# EAGLE design arduino_mega_shield (EAGLE 7.4.0)
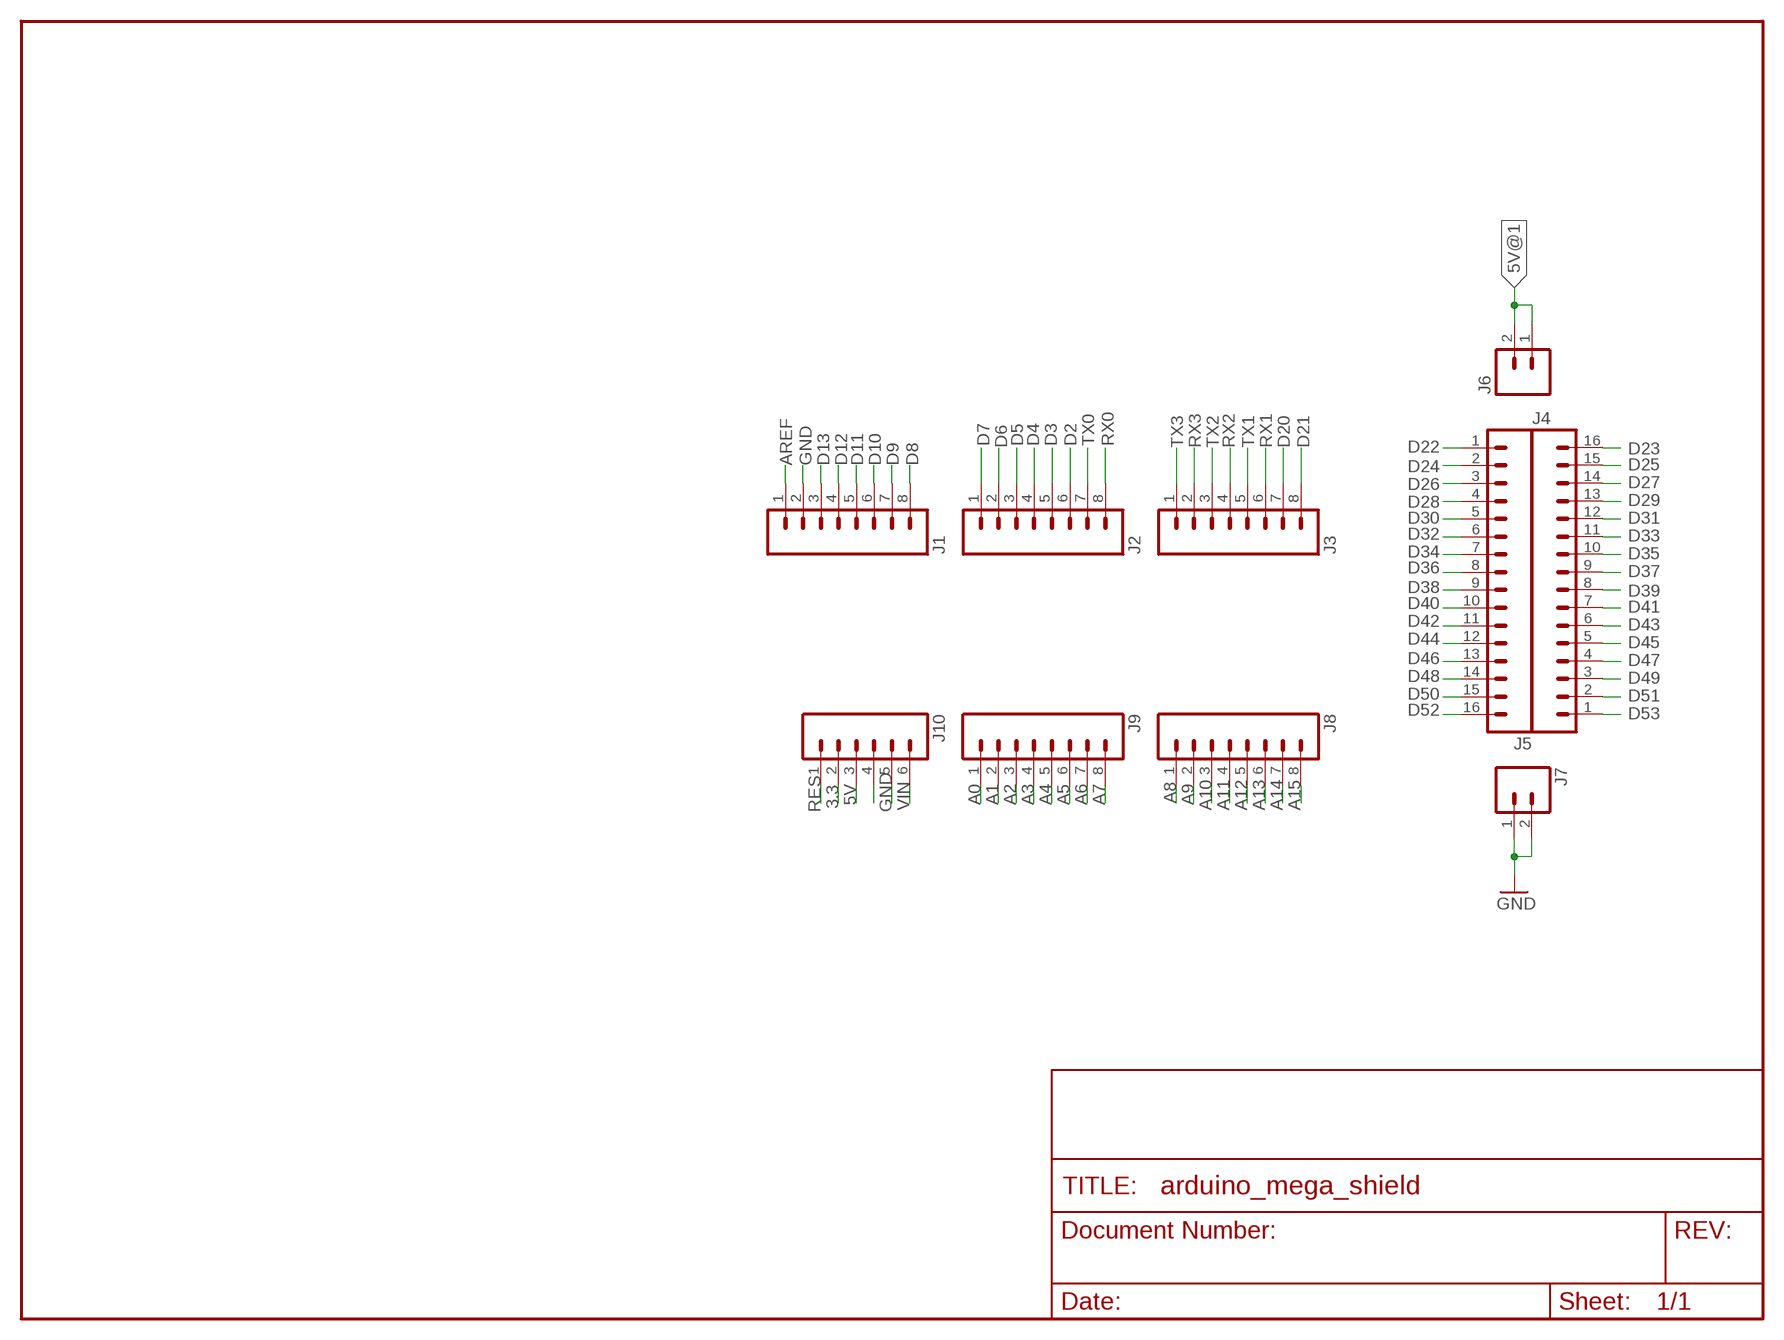
[diagram p0: schematic, sheet 1]

## Parts
J1  M08LONGPADS  [1X08_LONGPADS]
J2  M08LONGPADS  [1X08_LONGPADS]
J3  M08LONGPADS  [1X08_LONGPADS]
J4  M16PTH  [1X16]
J5  M16PTH  [1X16]
J6  M02PTH  [1X02]
J7  M02PTH  [1X02]
J8  M08LONGPADS  [1X08_LONGPADS]
J9  M08LONGPADS  [1X08_LONGPADS]
J10  M06LONGPADS  [1X06_LONGPADS]

## Nets
3.3: J10.2
5V: J10.3
5V@1: J6.1 J6.2
A0: J9.1
A1: J9.2
A2: J9.3
A3: J9.4
A4: J9.5
A5: J9.6
A6: J9.7
A7: J9.8
A8: J8.1
A9: J8.2
A10: J8.3
A11: J8.4
A12: J8.5
A13: J8.6
A14: J8.7
A15: J8.8
AREF: J1.1
D2: J2.6
D3: J2.5
D4: J2.4
D5: J2.3
D6: J2.2
D7: J2.1
D8: J1.8
D9: J1.7
D10: J1.6
D11: J1.5
D12: J1.4
D13: J1.3
D20: J3.7
D21: J3.8
D22: J5.1
D23: J4.16
D24: J5.2
D25: J4.15
D26: J5.3
D27: J4.14
D28: J5.4
D29: J4.13
D30: J5.5
D31: J4.12
D32: J5.6
D33: J4.11
D34: J5.7
D35: J4.10
D36: J5.8
D37: J4.9
D38: J5.9
D39: J4.8
D40: J5.10
D41: J4.7
D42: J5.11
D43: J4.6
D44: J5.12
D45: J4.5
D46: J5.13
D47: J4.4
D48: J5.14
D49: J4.3
D50: J5.15
D51: J4.2
D52: J5.16
D53: J4.1
GND: J1.2 J7.1 J7.2 J10.4 J10.5
RES: J10.1
RX0: J2.8
RX1: J3.6
RX2: J3.4
RX3: J3.2
TX0: J2.7
TX1: J3.5
TX2: J3.3
TX3: J3.1
VIN: J10.6

## Library data of the parts
J1-J3 J8 J9 = mecatronica_eagle_lib:M08: Header 8 Standard 8-pin 0.1" header. Use with straight break away headers (SKU : PRT-00116), right angle break away headers (PRT-00553), swiss pins (PRT-00743), machine pins (PRT-00117), and female headers (PRT-00115).
J4 J5 = mecatronica_eagle_lib:M16: 1x16 .1" header
J6 J7 = mecatronica_eagle_lib:M02: Standard 2-pin 0.1" header. Use with - straight break away headers ( PRT-00116) - right angle break away headers (PRT-00553) - swiss pins (PRT-00743) - machine pins (PRT-00117) - female headers (PRT-00115) Molex polarized connector foot print use with: PRT-08233 with associated crimp pins and housings. 2.54_SCREWTERM for use with PRT-10571. 3.5mm Screw Terminal footprints for PRT-08084 5mm Screw Terminal footprints for use with PRT-08432
J10 = mecatronica_eagle_lib:M06: Header 6 Standard 6-pin 0.1" header. Use with straight break away headers (SKU : PRT-00116), right angle break away headers (PRT-00553), swiss pins (PRT-00743), machine pins (PRT-00117), and female headers (PRT-00115). Molex polarized connector foot print use with SKU : PRT-08094 with associated crimp pins and housings. NOTES ON THE VARIANTS LOCK and LOCK_LONGPADS... This footprint was designed to help hold the alignment of a through-hole component (i.e. 6-pin header) while soldering it into place. You may notice that each hole has been shifted either up or down by 0.005 of an inch from it's more standard position (which is a perfectly straight line). This slight alteration caused the pins (the squares in the middle) to touch the edges of the holes. Because they are alternating, it causes a "brace" to hold the component in place. 0.005 has proven to be the perfect amount of "off-center" position when using our standard breakaway headers. Although looks a little odd when you look at the bare footprint, once you have a header in there, the alteration is very hard to notice. Also,if you push a header all the way into place, it is covered up entirely on the bottom side. This idea of altering the position of holes to aid alignment will be further integrated into the Sparkfun Library for other footprints. It can help hold any component with 3 or more connection pins.

## Board
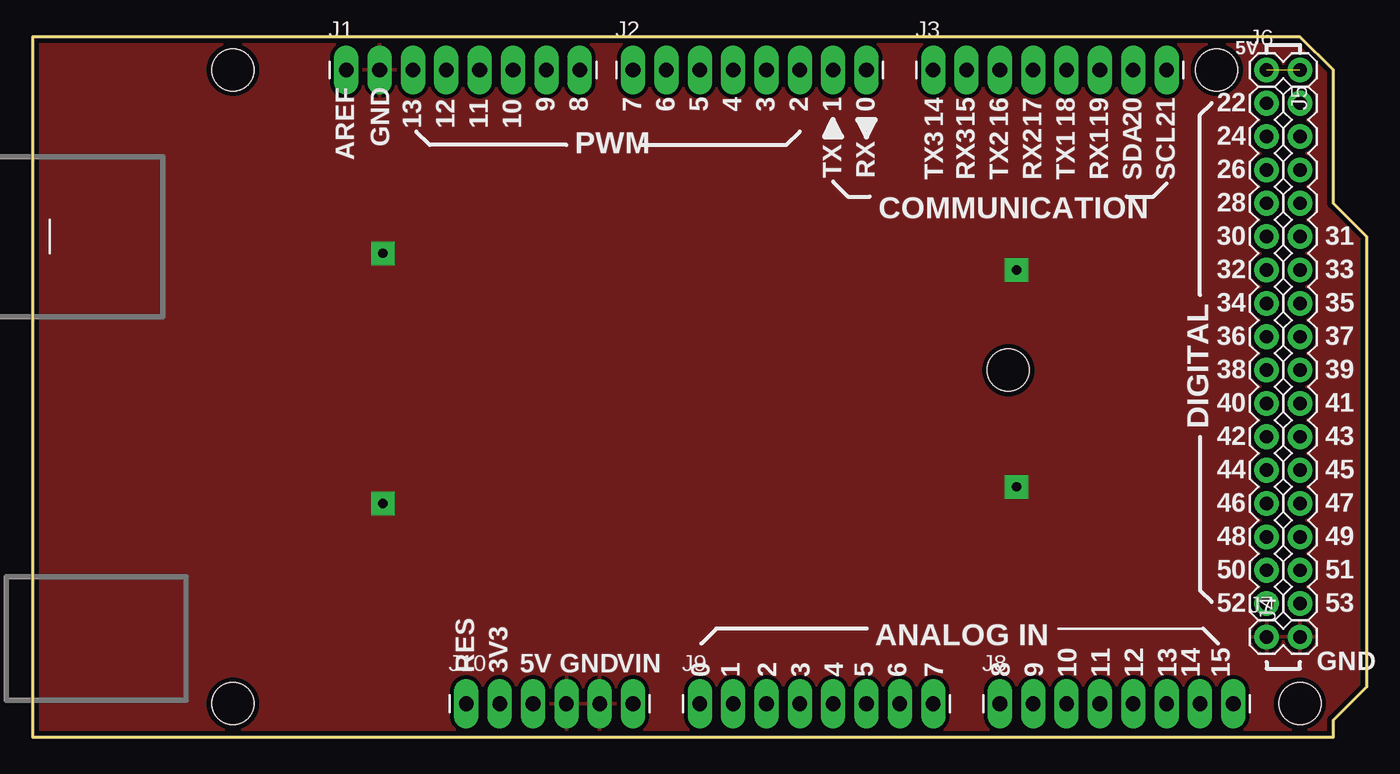
[diagram p1: board, top side]
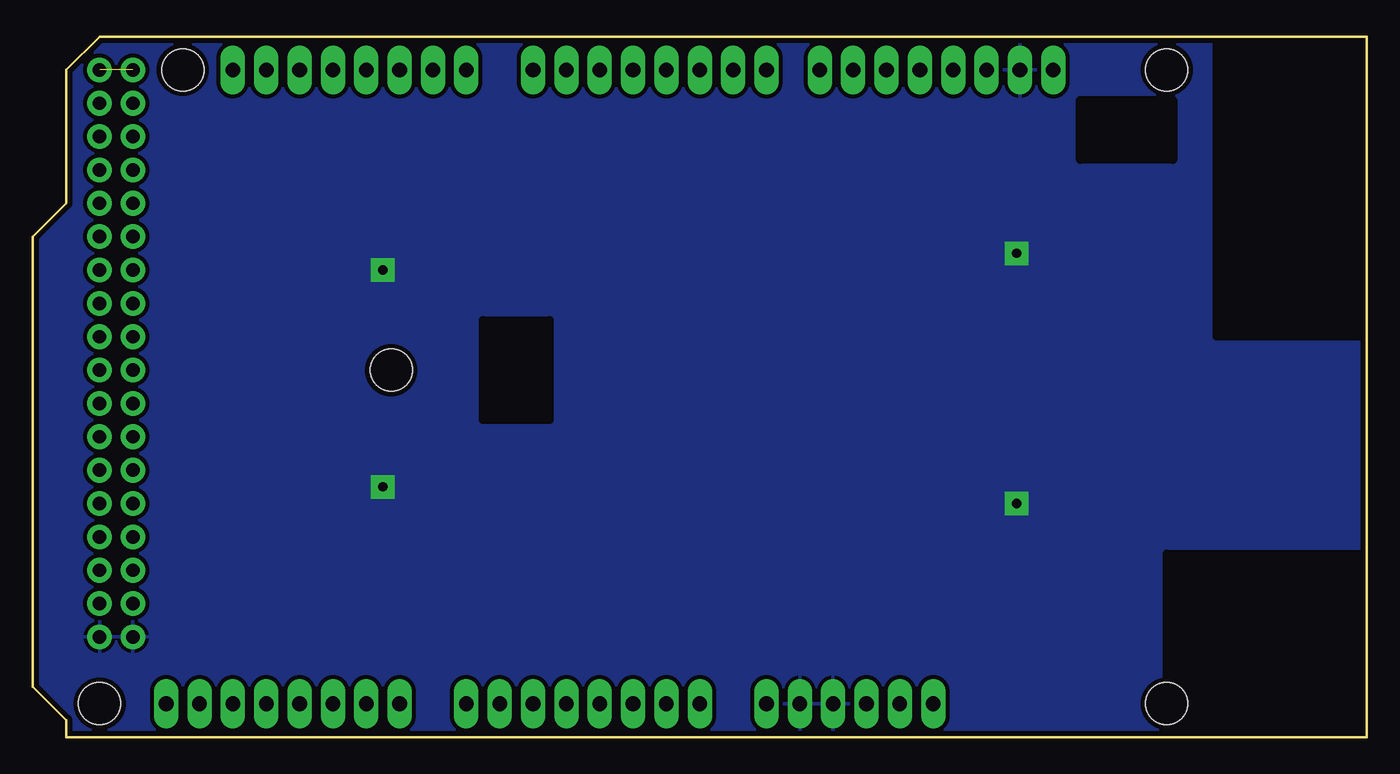
[diagram p2: board, bottom side, seen from below]

Size 101.6 x 53.34 mm. Coordinates in mm from the lower left corner, seen from the top.
Outline: 0,0 99.06,0 99.06,1.27 101.6,3.81 101.6,38.1 99.06,40.64 99.06,50.8 96.52,53.34 0,53.34 0,0
Copper layers (1*16): Top 0.035mm / dielectric 1.5mm / Bottom 0.035mm
Design rules "config_through_hole": minimum track width 8mil, minimum drill 20mil, track to track 9mil, track to pad 9mil, pad to pad 9mil, via to via 9mil, smd to smd 8mil, copper to edge 15mil, drill to drill 8mil, minimum pad ring 12mil, minimum via ring 10mil, stop-mask expansion 4mil, vias tented up to drill 25mil, thermal gap 10mil
Holes 3.2 mm at 15.24,50.8 15.24,2.54 90.17,50.8 96.52,2.54 74.3,27.94
bRestrict: area 62.2,24.1 to 67.3,31.8; area 14.7,43.9 to 21.8,48.5; area 0,30.5 to 11.4,53.3; area 0,0 to 15.2,14

### Footprints (pad centres in the part's own frame; a part is rotated, then mirrored left to right if it is on the bottom)
1X08_LONGPADS = drill 1.118 pad 1.88 long: 1 0,0; 2 2.54,0; 3 5.08,0; 4 7.62,0; 5 10.16,0; 6 12.7,0; 7 15.24,0; 8 17.78,0
1X16 = drill 1.016 pad 1.88: 1 0,0; 2 2.54,0; 3 5.08,0; 4 7.62,0; 5 10.16,0; 6 12.7,0; 7 15.24,0; 8 17.78,0; 9 20.32,0; 10 22.86,0; 11 25.4,0; 12 27.94,0; 13 30.48,0; 14 33.02,0; 15 35.56,0; 16 38.1,0
1X02 = drill 1.016 pad 1.88: 1 0,0; 2 2.54,0
1X06_LONGPADS = drill 1.118 pad 1.88 long: 1 0,0; 2 2.54,0; 3 5.08,0; 4 7.62,0; 5 10.16,0; 6 12.7,0

### Placement (x,y rotation side)
J1  23.88,50.8 0 top
J2  45.72,50.8 0 top
J3  68.58,50.8 0 top
J4  96.52,10.16 90 top
J5  93.98,48.26 270 top
J6  93.98,50.8 0 top
J7  93.98,7.62 0 top
J8  73.66,2.54 0 top
J9  50.8,2.54 0 top
J10  33.02,2.54 0 top

### Tracks (layer width: path | path; a pad name or v marks a point on that pad's centre or on a via)
5V@1  (1 unrouted)
GND  (via drill 0.7 pad 1.78)
  other vias: 26.67,17.78 74.93,19.05 74.93,35.56 26.67,36.83
  pour Bottom (isolate 0.305): 0,0 99.06,0 99.06,1.27 101.6,3.81 101.6,38.1 99.06,40.64 99.06,50.8 96.52,53.34 21.97,53.34 0,53.34
  pour Top (isolate 0.305): 0,0 99.06,0 99.06,1.27 101.6,3.81 101.6,38.1 99.06,40.64 99.06,50.8 96.52,53.34 0,53.34 0,2.54

### Text on the board
tPlace: 5V | 9 | 8 | 7 | 6 | 5 | 4 | 3 | 2 | 1 | 0 | 22 | 13 | 12 | 11 | 10 | 14 | 15 | 16 | 17 | 18 | 19 | 20 | 21 | GND | 24 | AREF | PWM | TX | RX | 26 | TX3 | RX3 | TX2 | RX2 | TX1 | RX1 | SDA | SCL | 28 | COMMUNICATION | 30 | 31 | 32 | 33 | 34 | 35 | 36 | 37 | 38 | 39 | 40 | 41 | DIGITAL | 42 | 43 | 44 | 45 | 46 | 47 | 48 | 49 | 50 | 51 | 52 | 53 | ANALOG IN | RES | 3V3 | 5V | GND | VIN | 0 | 1 | 2 | 3 | 4 | 5 | 6 | 7 | 8 | 9 | 10 | 11 | 12 | 13 | 14 | 15 | GND
tDocu: USB | PWR